# Altium schematic sheet Zhonji_ai8051__Board1_Schematic1__2_P2.schdoc
size 431 x 309 mm; Symbol: Sheet-Symbol_A4; Device: Sheet-Symbol_A4; Company: 嘉立创EDA; Version: V1.0; Page Size: A4; @Project Name: Ai8051U创意; @Page Count: 4; @Update Date: 2024-11-17; @Create Date: 2024-11-17; @Schematic Name: Schematic1; @Page No: 2; @Page Name: P2; Title Block Position: 3; Width: 1655; Height: 1170; Region Start: 1; X Region Count: 6; Y Region Count: 4; Blade Width: 10; @Board Name: Board1; @Create Time: 17:57:33; @Update Time: 17:57:33
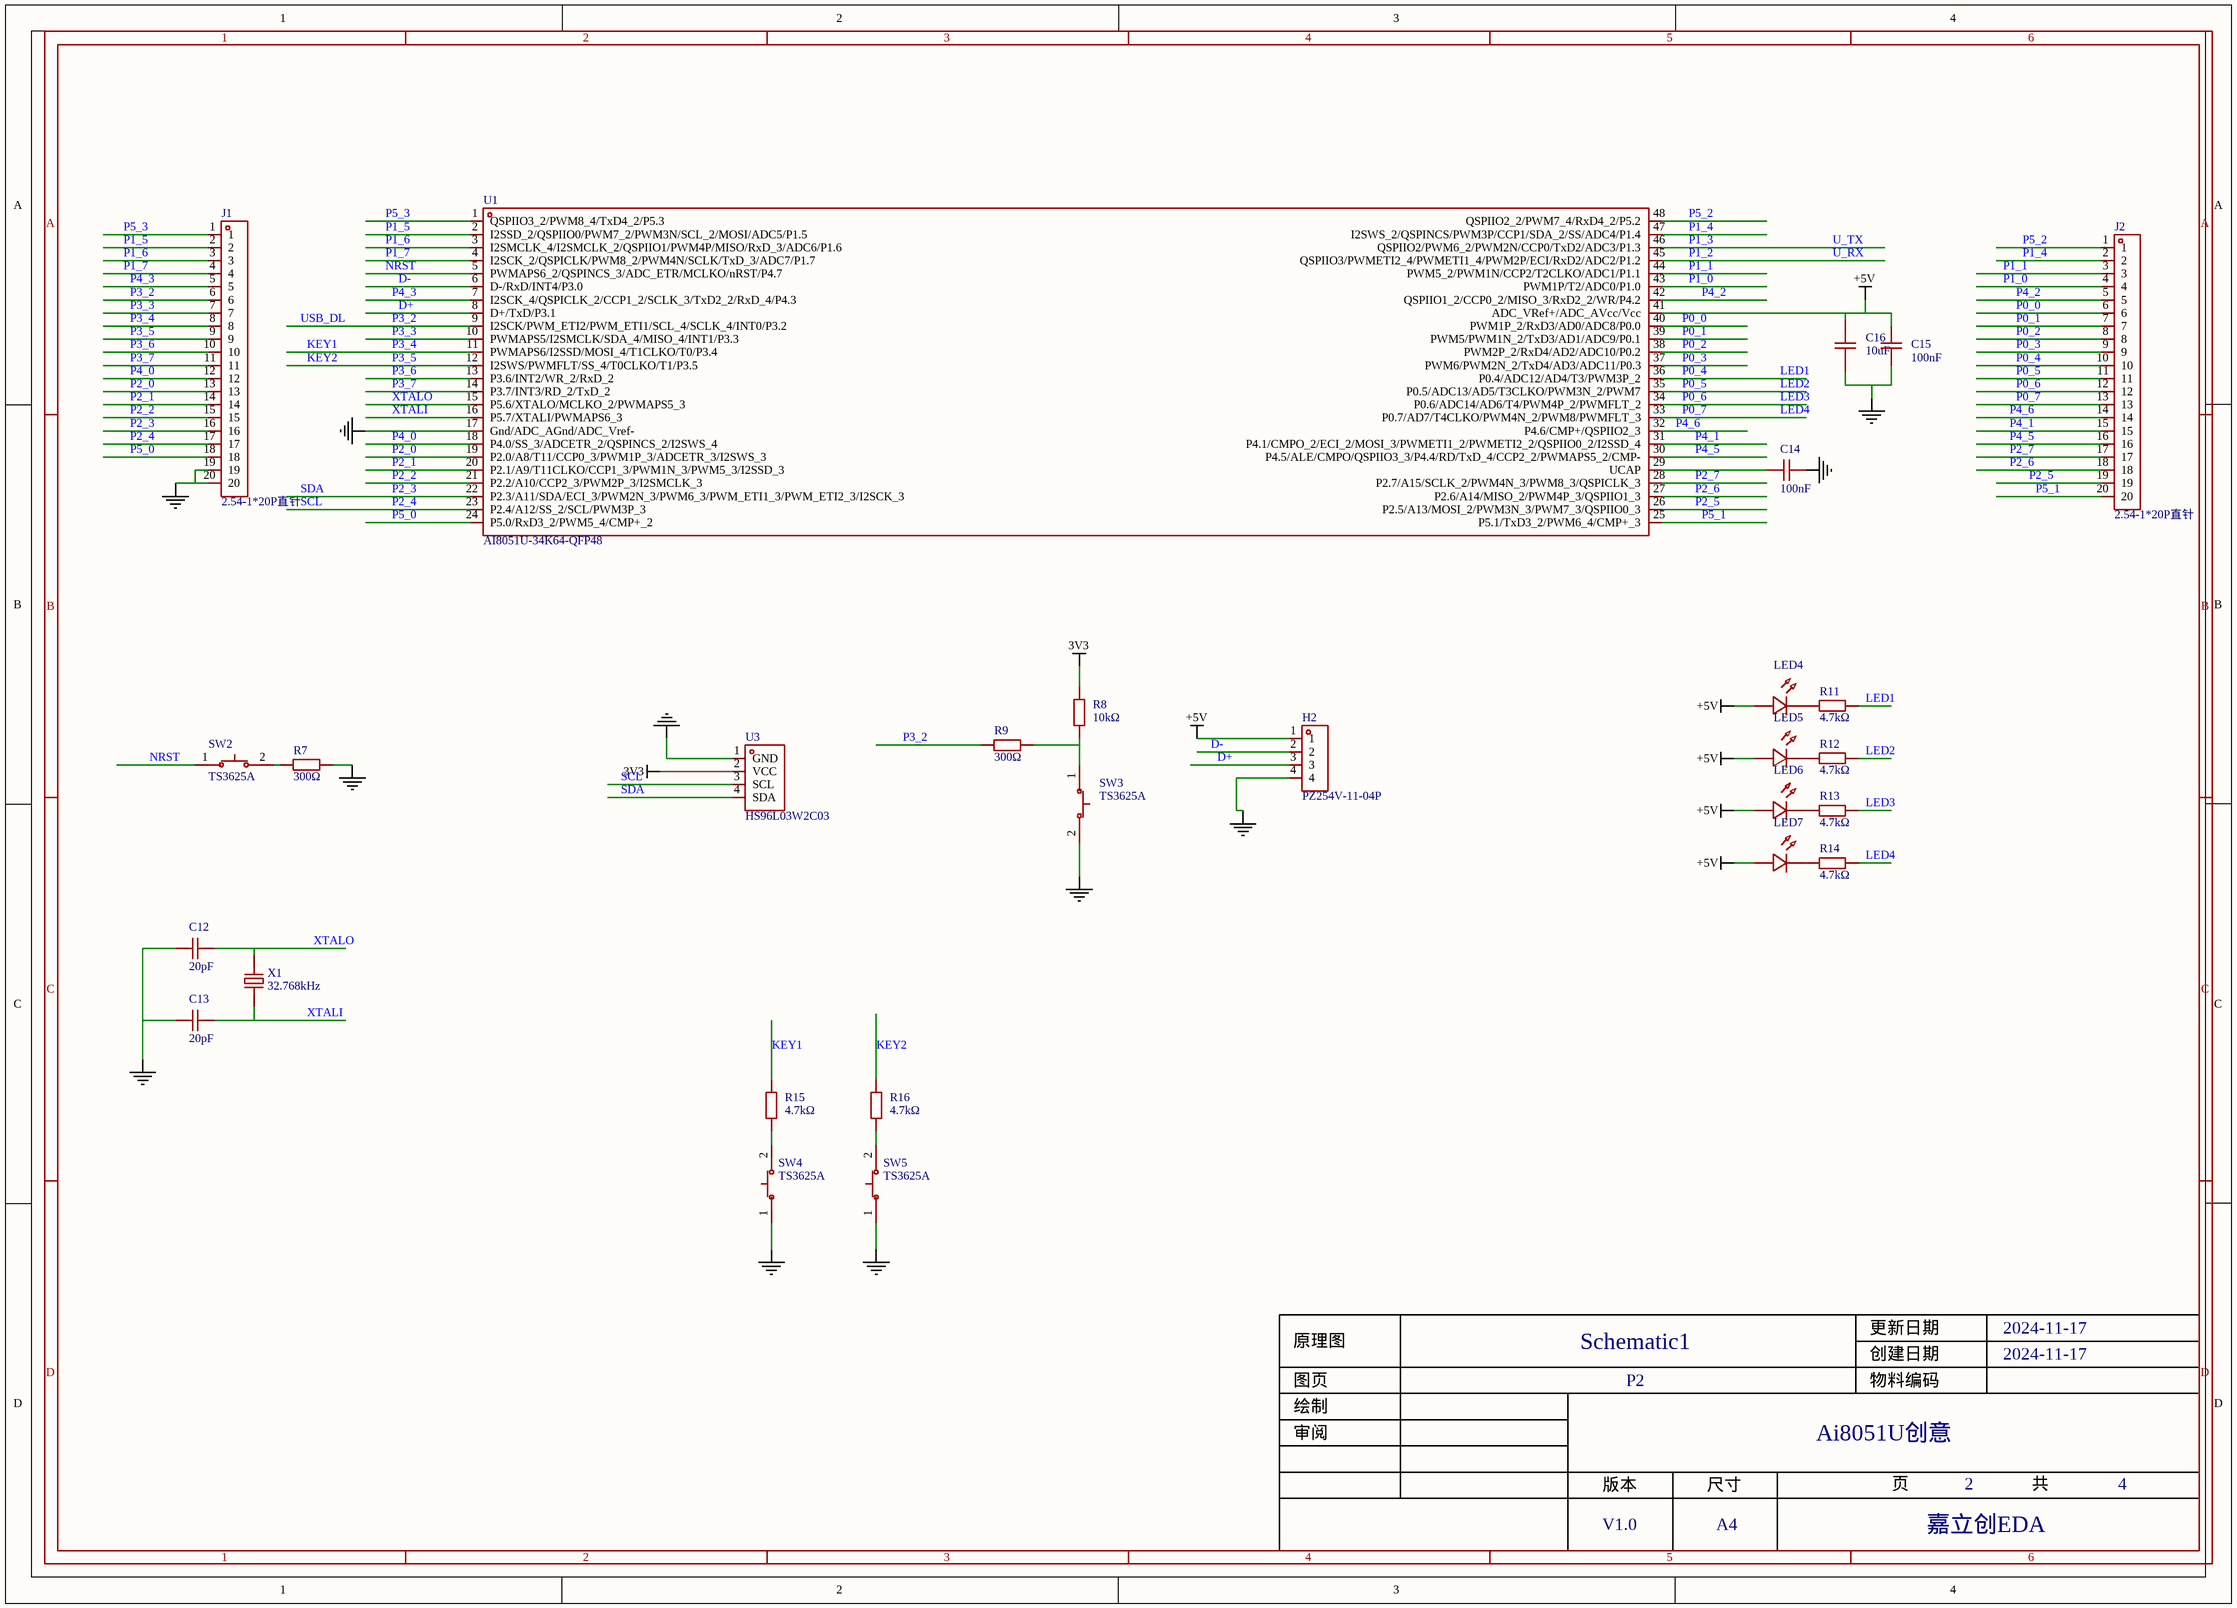
[diagram p0: Zhonji_ai8051__Board1_Schematic1__2_P2.schdoc]

## Parts
C12  20pF  [C0603]  (value not drawn)
C13  20pF  [C0603]  (value not drawn)
C14  100nF  [C0603]  (value not drawn)
C15  100nF  [C0603]  (value not drawn)
C16  10uF  [C0603]  (value not drawn)
H2  PZ254V-11-04P  [HDR-TH_4P-P2.54-V-M]  (value not drawn)
J1  2.54-1*20P直针  [HDR-TH_20P-P2.54-V-M-1]  (value not drawn)
J2  2.54-1*20P直针  [HDR-TH_20P-P2.54-V-M-1]  (value not drawn)
LED4  LED_0603-B  [LED_0603]  (value not drawn)
LED5  LED_0603-B  [LED_0603]  (value not drawn)
LED6  LED_0603-B  [LED_0603]  (value not drawn)
LED7  LED_0603-B  [LED_0603]  (value not drawn)
R7  300Ω  [R0603]  (value not drawn)
R8  10kΩ  [R0603]  (value not drawn)
R9  300Ω  [R0603]  (value not drawn)
R11  4.7kΩ  [R0603]  (value not drawn)
R12  4.7kΩ  [R0603]  (value not drawn)
R13  4.7kΩ  [R0603]  (value not drawn)
R14  4.7kΩ  [R0603]  (value not drawn)
R15  4.7kΩ  [R0603]  (value not drawn)
R16  4.7kΩ  [R0603]  (value not drawn)
SW2  TS3625A  [KEY-SMD_L6.0-W3.5-LS8.4]  (value not drawn)
SW3  TS3625A  [KEY-SMD_L6.0-W3.5-LS8.4]  (value not drawn)
SW4  TS3625A  [KEY-SMD_L6.0-W3.5-LS8.4]  (value not drawn)
SW5  TS3625A  [KEY-SMD_L6.0-W3.5-LS8.4]  (value not drawn)
U1  AI8051U-34K64-QFP48  [LQFP-48_L7.0-W7.0-P0.50-LS9.0-BL_1]  (value not drawn)
U3  HS96L03W2C03  [OLED-TH_L27.8-W27.2-P2.54_C9900033791]  (value not drawn)
X1  32.768kHz  [OSC-SMD_L3.2-W1.5]  (value not drawn)

## Nets
3V3: R8.2 U3.2(VCC)
+5V: C15.2 C16.2 H2.1 LED4.2(A) LED5.2(A) LED6.2(A) LED7.2(A) U1.41(ADC_VRef+/ADC_AVcc/Vcc)
GND: C12.1 C13.1 C14.1 C15.1 C16.1 H2.4 J1.19 J1.20 R7.2 SW3.2 SW4.1 SW5.1 U1.17(Gnd/ADC_AGnd/ADC_Vref-) U3.1(GND)
D+: H2.3 U1.8(D+/TxD/P3.1)
D-: H2.2 U1.6(D-/RxD/INT4/P3.0)
KEY1: J1.8 R15.2 U1.11(PWMAPS6/I2SSD/MOSI_4/T1CLKO/T0/P3.4)  [also labelled P3_4]
KEY2: J1.9 R16.2 U1.12(I2SWS/PWMFLT/SS_4/T0CLKO/T1/P3.5)  [also labelled P3_5]
LED1: J2.10 R11.2 U1.36(P0.4/ADC12/AD4/T3/PWM3P_2)  [also labelled P0_4]
LED2: J2.11 R12.2 U1.35(P0.5/ADC13/AD5/T3CLKO/PWM3N_2/PWM7)  [also labelled P0_5]
LED3: J2.12 R13.2 U1.34(P0.6/ADC14/AD6/T4/PWM4P_2/PWMFLT_2)  [also labelled P0_6]
LED4: J2.13 R14.2 U1.33(P0.7/AD7/T4CLKO/PWM4N_2/PWM8/PWMFLT_3)  [also labelled P0_7]
NRST: SW2.1 U1.5(PWMAPS6_2/QSPINCS_3/ADC_ETR/MCLKO/nRST/P4.7)
P0_0: J2.6 U1.40(PWM1P_2/RxD3/AD0/ADC8/P0.0)
P0_1: J2.7 U1.39(PWM5/PWM1N_2/TxD3/AD1/ADC9/P0.1)
P0_2: J2.8 U1.38(PWM2P_2/RxD4/AD2/ADC10/P0.2)
P0_3: J2.9 U1.37(PWM6/PWM2N_2/TxD4/AD3/ADC11/P0.3)
P1_0: J2.4 U1.43(PWM1P/T2/ADC0/P1.0)
P1_1: J2.3 U1.44(PWM5_2/PWM1N/CCP2/T2CLKO/ADC1/P1.1)
P1_2: U1.45(QSPIIO3/PWMETI2_4/PWMETI1_4/PWM2P/ECI/RxD2/ADC2/P1.2)  [also labelled U_RX]
P1_3: U1.46(QSPIIO2/PWM6_2/PWM2N/CCP0/TxD2/ADC3/P1.3)  [also labelled U_TX]
P1_4: J2.2 U1.47(I2SWS_2/QSPINCS/PWM3P/CCP1/SDA_2/SS/ADC4/P1.4)
P1_5: J1.2 U1.2(I2SSD_2/QSPIIO0/PWM7_2/PWM3N/SCL_2/MOSI/ADC5/P1.5)
P1_6: J1.3 U1.3(I2SMCLK_4/I2SMCLK_2/QSPIIO1/PWM4P/MISO/RxD_3/ADC6/P1.6)
P1_7: J1.4 U1.4(I2SCK_2/QSPICLK/PWM8_2/PWM4N/SCLK/TxD_3/ADC7/P1.7)
P2_0: J1.13 U1.19(P2.0/A8/T11/CCP0_3/PWM1P_3/ADCETR_3/I2SWS_3)
P2_1: J1.14 U1.20(P2.1/A9/T11CLKO/CCP1_3/PWM1N_3/PWM5_3/I2SSD_3)
P2_2: J1.15 U1.21(P2.2/A10/CCP2_3/PWM2P_3/I2SMCLK_3)
P2_3: J1.16 U1.22(P2.3/A11/SDA/ECI_3/PWM2N_3/PWM6_3/PWM_ETI1_3/PWM_ETI2_3/I2SCK_3) U3.4(SDA)  [also labelled SDA]
P2_4: J1.17 U1.23(P2.4/A12/SS_2/SCL/PWM3P_3) U3.3(SCL)  [also labelled SCL]
P2_5: J2.19 U1.26(P2.5/A13/MOSI_2/PWM3N_3/PWM7_3/QSPIIO0_3)
P2_6: J2.18 U1.27(P2.6/A14/MISO_2/PWM4P_3/QSPIIO1_3)
P2_7: J2.17 U1.28(P2.7/A15/SCLK_2/PWM4N_3/PWM8_3/QSPICLK_3)
P3_2: J1.6 R9.1 U1.9(I2SCK/PWM_ETI2/PWM_ETI1/SCL_4/SCLK_4/INT0/P3.2)  [also labelled USB_DL]
P3_3: J1.7 U1.10(PWMAPS5/I2SMCLK/SDA_4/MISO_4/INT1/P3.3)
P3_6: J1.10 U1.13(P3.6/INT2/WR_2/RxD_2)
P3_7: J1.11 U1.14(P3.7/INT3/RD_2/TxD_2)
P4_0: J1.12 U1.18(P4.0/SS_3/ADCETR_2/QSPINCS_2/I2SWS_4)
P4_1: J2.15 U1.31(P4.1/CMPO_2/ECI_2/MOSI_3/PWMETI1_2/PWMETI2_2/QSPIIO0_2/I2SSD_4)
P4_2: J2.5 U1.42(QSPIIO1_2/CCP0_2/MISO_3/RxD2_2/WR/P4.2)
P4_3: J1.5 U1.7(I2SCK_4/QSPICLK_2/CCP1_2/SCLK_3/TxD2_2/RxD_4/P4.3)
P4_5: J2.16 U1.30(P4.5/ALE/CMPO/QSPIIO3_3/P4.4/RD/TxD_4/CCP2_2/PWMAPS5_2/CMP-)
P4_6: J2.14 U1.32(P4.6/CMP+/QSPIIO2_3)
P5_0: J1.18 U1.24(P5.0/RxD3_2/PWM5_4/CMP+_2)
P5_1: J2.20 U1.25(P5.1/TxD3_2/PWM6_4/CMP+_3)
P5_2: J2.1 U1.48(QSPIIO2_2/PWM7_4/RxD4_2/P5.2)
P5_3: J1.1 U1.1(QSPIIO3_2/PWM8_4/TxD4_2/P5.3)
XTALI: C13.2 U1.16(P5.7/XTALI/PWMAPS6_3) X1.1
XTALO: C12.2 U1.15(P5.6/XTALO/MCLKO_2/PWMAPS5_3) X1.2
NetC14_2: C14.2 U1.29(UCAP)
NetLED4_1: LED4.1(C) R11.1
NetLED5_1: LED5.1(C) R12.1
NetLED6_1: LED6.1(C) R13.1
NetLED7_1: LED7.1(C) R14.1
NetR7_1: R7.1 SW2.2
NetR8_1: R8.1 R9.2 SW3.1
NetR15_1: R15.1 SW4.2
NetR16_1: R16.1 SW5.2

## Notes on the sheet
- 1
- 2
- 3
- 4
- 5
- 6
- A
- B
- C
- D
- 原理图
- Schematic1
- 创建日期
- 更新日期
- 2024-11-17
- 审阅
- 绘制
- 图页
- P2
- 物料编码
- Ai8051U创意
- 版本
- 尺寸
- 页
- 共
- V1.0
- A4
- 嘉立创EDA

## Library data of the parts
C12 C13 = CL10C200JB8NNNC: 容值:20pF;精度:±5%;额定电压:50V;材质(温度系数):C0G;; Manufacturer: SAMSUNG(三星); Add into BOM: yes; Tolerance: ±5%; Voltage Rated: 50V; Temperature Coefficient: C0G; Symbol: CL10C200JB8NNNC; Device: CL10C200JB8NNNC; LCSC Part Name: 20pF ±5% 50V; Supplier Part: C1648; Manufacturer Part: CL10C200JB8NNNC; Supplier Footprint: 0603; JLCPCB Part Class: 基础库; Datasheet: https://atta.szlcsc.com/upload/public/pdf/source/20160218/1457707763339.pdf; Supplier: LCSC; Convert to PCB: yes; Value: 20pF
C14 C15 = CT41G-0603-2X1-50V-0.1μF-K(N): 容值:100nF;精度:±10%;额定电压:50V;材质(温度系数):2X1;; Manufacturer: TORCH(火炬); Add into BOM: yes; Tolerance: ±10%; Voltage Rated: 50V; Temperature Coefficient: 2X1; Symbol: CT41G-0603-2X1-50V-0.1μF-K(N); Device: CT41G-0603-2X1-50V-0.1μF-K(N); LCSC Part Name: 100nF ±10% 50V; Supplier Part: C125205; Manufacturer Part: CT41G-0603-2X1-50V-0.1μF-K(N); Supplier Footprint: 0603; JLCPCB Part Class: 扩展库; Datasheet: https://atta.szlcsc.com/upload/public/pdf/source/20171225/C150708_15141883600121203188.pdf; Supplier: LCSC; Convert to PCB: yes; Value: 100nF
C16 = CL10A106MA8NRNC: 容值:10uF;精度:±20%;额定电压:25V;材质(温度系数):X5R;; Manufacturer: SAMSUNG(三星); Add into BOM: yes; Tolerance: ±20%; Voltage Rated: 25V; Temperature Coefficient: X5R; Symbol: CL10A106MA8NRNC; Device: CL10A106MA8NRNC; LCSC Part Name: 10uF ±20% 25V; Supplier Part: C96446; Manufacturer Part: CL10A106MA8NRNC; Supplier Footprint: 0603; JLCPCB Part Class: 基础库; Datasheet: https://atta.szlcsc.com/upload/public/pdf/source/20160218/1457707763339.pdf; Supplier: LCSC; Convert to PCB: yes; Value: 10uF
H2 = PZ254V-11-04P: 插针结构:1x4P;间距:2.54mm;行距:-;圆针/方针:方针;安装类型:直插;排数:单排;总PIN位数:4P;额定电流:3A;额定电压:250V;配合针长度:6mm;塑高:2.5mm;端接针长度:3mm;触头材质:-;工作温度范围:-40℃~+105℃;颜色:黑色;; Manufacturer: XFCN(兴飞); Symbol: PZ254V-11-04P_C2691448; Add into BOM: yes; Pin Structure: 1x4P; Pitch: 2.54mm; Circluar Pins/Square Pins: 方针; Current Rating (Max): 3A; Voltage Rating (Max): 250V; Device: PZ254V-11-04P; LCSC Part Name: 间距:2.54mm 1x4P 直插 方针; Supplier Part: C2691448; Manufacturer Part: PZ254V-11-04P; Supplier Footprint: 插件,P=2.54mm; JLCPCB Part Class: 扩展库; Datasheet: https://atta.szlcsc.com/upload/public/pdf/source/20200309/C492403_F9F19131791D08044AD4F84F8E751A34.pdf; Supplier: LCSC; Convert to PCB: yes; Row Spacing: -; Mounting Type: 直插; Number of Rows: 单排; Number of Pins: 4P; Length of Mating Pin: 6mm; Insulation Height: 2.5mm; Length of End Connection Pin: 3mm; Contact Material: -; Operating Temperature Range: -40℃~+105℃; Color: 黑色
J1 J2 = 2.54-1*20P直针: 插针结构:1x20P;间距:2.54mm;行距:-;圆针/方针:方针;安装类型:直插;排数:单排;总PIN位数:20P;额定电流:3A;额定电压:-;配合针长度:-;塑高:-;端接针长度:-;触头材质:黄铜;触头镀层:-;工作温度范围:-40℃~+105℃;颜色:黑色;; Manufacturer: BOOMELE(博穆精密); Symbol: Header-Male-2.54_1x20; Add into BOM: yes; Pin Structure: 1x20P; Pitch: 2.54mm; Circluar Pins/Square Pins: 方针; Current Rating (Max): 3A; Device: 2.54-1*20P直针; LCSC Part Name: 间距:2.54mm 1x20P 直插 方针; Supplier Part: C50981; Manufacturer Part: 2.54-1*20P直针; Supplier Footprint: 插件,P=2.54mm; JLCPCB Part Class: 扩展库; Datasheet: https://atta.szlcsc.com/upload/public/pdf/source/20151109/1457707572883.pdf; Supplier: LCSC; Convert to PCB: yes; Row Spacing: -; Mounting Type: 直插; Number of Rows: 单排; Number of Pins: 20P; Voltage Rating (Max): -; Length of Mating Pin: -; Insulation Height: -; Length of End Connection Pin: -; Contact Material: 黄铜; Contact Plating: -; Operating Temperature Range: -40℃~+105℃; Color: 黑色
LED4-LED7 = LED_0603-B: Symbol: LED_B; Convert to PCB: yes; Device: LED_0603-B; Add into BOM: yes; Supplier Footprint: 0603
R7 R9 = 0603WAF3000T5E: 电阻类型:厚膜电阻;阻值:300Ω;精度:±1%;功率:100mW;最大工作电压:75V;温度系数:±100ppm/℃;; Manufacturer: UNI-ROYAL(厚声); Add into BOM: yes; Tolerance: ±1%; Power(Watts): 100mW; Overload Voltage (Max): 75V; Symbol: 0603WAF3000T5E; Device: 0603WAF3000T5E; LCSC Part Name: 300Ω ±1% 100mW 厚膜电阻; Supplier Part: C23025; Manufacturer Part: 0603WAF3000T5E; Supplier Footprint: 0603; JLCPCB Part Class: 基础库; Datasheet: https://atta.szlcsc.com/upload/public/pdf/source/20200306/C422600_1E6D84923E4A46A82E41ADD87F860B5C.pdf; Supplier: LCSC; Convert to PCB: yes; Type: 厚膜电阻; Value: 300Ω; Temperature Coefficient: ±100ppm/℃; Operating Temperature Range: -55℃~+155℃
R8 = 0603WAF1002T5E: 电阻类型:厚膜电阻;阻值:10kΩ;精度:±1%;功率:100mW;最大工作电压:75V;温度系数:±100ppm/℃;; Manufacturer: UNI-ROYAL(厚声); Add into BOM: yes; Tolerance: ±1%; Power(Watts): 100mW; Overload Voltage (Max): 75V; Symbol: 0603WAF1002T5E; Device: 0603WAF1002T5E; LCSC Part Name: 厚膜电阻 10kΩ ±1% 100mW; Supplier Part: C25804; Manufacturer Part: 0603WAF1002T5E; Supplier Footprint: 0603; JLCPCB Part Class: 基础库; Datasheet: https://atta.szlcsc.com/upload/public/pdf/source/20200306/C422600_1E6D84923E4A46A82E41ADD87F860B5C.pdf; Supplier: LCSC; Convert to PCB: yes; Type: 厚膜电阻; Value: 10kΩ; Temperature Coefficient: ±100ppm/℃; Operating Temperature Range: -55℃~+155℃
R11-R16 = 0603WAF4701T5E: 电阻类型:厚膜电阻;阻值:4.7kΩ;精度:±1%;功率:100mW;最大工作电压:75V;温度系数:±100ppm/℃;; Manufacturer: UNI-ROYAL(厚声); Add into BOM: yes; Tolerance: ±1%; Power(Watts): 100mW; Overload Voltage (Max): 75V; Symbol: 0603WAF4701T5E; Device: 0603WAF4701T5E; LCSC Part Name: 4.7kΩ ±1% 100mW 厚膜电阻; Supplier Part: C23162; Manufacturer Part: 0603WAF4701T5E; Supplier Footprint: 0603; JLCPCB Part Class: Basic Part; Datasheet: https://atta.szlcsc.com/upload/public/pdf/source/20200306/C422600_1E6D84923E4A46A82E41ADD87F860B5C.pdf; Supplier: LCSC; Convert to PCB: yes; Type: 厚膜电阻; Value: 4.7kΩ; Temperature Coefficient: ±100ppm/℃; Operating Temperature Range: -55℃~+155℃
SW2-SW5 = TS3625A: 电路结构:单刀单掷;按钮形状:矩形按钮;作用力:250gf;安装方式:立贴;开关长度:6.1mm;开关宽度:3.65mm;开关高度:2.5mm;触点电流:50mA;额定电压(DC):12V;带灯:-;机械寿命:-;; Manufacturer: SHOU HAN(首韩); Add into BOM: yes; Circuit: 单刀单掷; Actuator Style: 矩形按钮; Operating Force: 250gf; Switch Length: 6.1mm; Switch Width: 3.65mm; Switch Height: 2.5mm; Contact Current: 50mA; Voltage Rating (DC): 12V; Symbol: TS3625A; Device: TS3625A; LCSC Part Name: 6.1*3.65*2.5mm 立贴 轻触开关; Supplier Part: C398053; Manufacturer Part: TS3625A; Supplier Footprint: SMD; JLCPCB Part Class: 扩展库; Datasheet: https://atta.szlcsc.com/upload/public/pdf/source/20190620/C398053_EFFFB524A3F966B1F45EE8333D1EDECC.pdf; Supplier: LCSC; Convert to PCB: yes; Mounting Style: 立贴; With Lamp: -; Mechanical Life: -
U1 = AI8051U-34K64-QFP48: 硬件浮点/硬件三角函数 跑100MHz, 32位8051-CPU 跑 42MHz，PWM 有硬件移相功能，DMA支持外设到外设，DMA支持PWM; Manufacturer: STC; Add into BOM: yes; Symbol: AI8051U-34K64-QFP48; Device: AI8051U-34K64-QFP48; LCSC Part Name: AI8051U-34K64-QFP48; Supplier Part: C41427635; Manufacturer Part: AI8051U-34K64-QFP48; Supplier Footprint: QFP-48; JLCPCB Part Class: 扩展库; Datasheet: https://atta.szlcsc.com/upload/public/pdf/source/20241012/98E0A3F17C9CC280218AE3F266CCDE47.pdf; Supplier: LCSC; Convert to PCB: yes
U3 = HS96L03W2C03: 主控芯片:SSD1315;接口类型:I2C;尺寸(inch):0.96;像素分辨率:128x64;; Manufacturer: HS(汉昇); Add into BOM: yes; Interface Type: I2C; Pixel Resolution: 128x64; Symbol: HS96L03W2C03; Device: HS96L03W2C03; LCSC Part Name: 0.96寸OLED显示屏窄白光IIC; Supplier Part: C5248080; Manufacturer Part: HS96L03W2C03; Supplier Footprint: -; JLCPCB Part Class: 扩展库; Datasheet: https://atta.szlcsc.com/upload/public/pdf/source/20230627/763D01F79A90007632F098068C7C8AD9.pdf; Supplier: LCSC; Convert to PCB: yes; Main Control Chip: SSD1315; Size: 0.96; Operating Temperature: -40℃~+70℃
X1 = X321532768KGD2SI: 晶振类型:贴片晶振;频率:32.768kHz;常温频差:±20ppm;外接负载电容:12.5pF;频率稳定度(全温):-;; Manufacturer: YXC(扬兴晶振); Add into BOM: yes; Crystal Type: 贴片晶振; Normal temperature Frequency Tolerance: ±20ppm; External load capacitor: 12.5pF; Symbol: X321532768KGD2SI; Device: X321532768KGD2SI; LCSC Part Name: 32.768kHz ±20ppm 12.5pF; Supplier Part: C620155; Manufacturer Part: X321532768KGD2SI; Supplier Footprint: SMD3215-2P; JLCPCB Part Class: 扩展库; Datasheet: https://atta.szlcsc.com/upload/public/pdf/source/20240329/3A7650FD985DD0DE85694D3785AB4916.pdf; Supplier: LCSC; Convert to PCB: yes; Value: 32.768kHz; Frequency Stability(Full temperature range): -; Operating Temperature: -40℃~+85℃